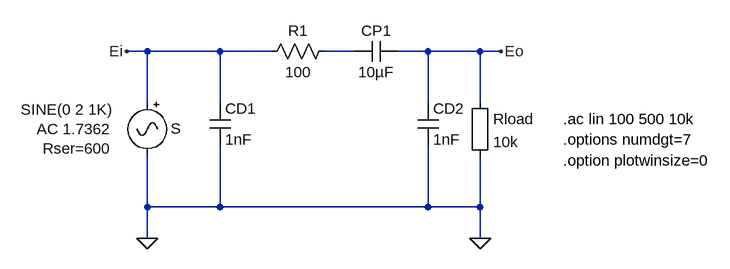
[diagram p0: schematic JT-11P-1HPC-Dhiru-Shorted-Via-Cap.asc]
JT-11P-1HPC-Dhiru-Shorted-Via-Cap.asc, the LTspice schematic file:
Version 4
SHEET 1 2372 788
WIRE 0 48 -32 48
WIRE 112 48 0 48
WIRE 192 48 112 48
WIRE 320 48 272 48
WIRE 432 48 384 48
WIRE 512 48 432 48
WIRE 544 48 512 48
WIRE 0 128 0 48
WIRE 112 128 112 48
WIRE 432 128 432 48
WIRE 512 128 512 48
WIRE 0 288 0 208
WIRE 112 288 112 192
WIRE 112 288 0 288
WIRE 432 288 432 192
WIRE 432 288 112 288
WIRE 512 288 512 208
WIRE 512 288 432 288
WIRE 0 336 0 288
WIRE 512 336 512 288
FLAG 512 336 0
FLAG 544 48 Eo
FLAG -32 48 Ei
FLAG 0 336 0
SYMBOL Misc\\signal 0 112 M0
WINDOW 0 -52 55 Left 2
WINDOW 3 53 26 Left 2
WINDOW 123 56 56 Left 2
WINDOW 39 55 86 Left 2
SYMATTR InstName S
SYMATTR Value SINE(0 2 1K)
SYMATTR Value2 AC 1.7362
SYMATTR SpiceLine Rser=600
SYMBOL Misc\\EuropeanResistor 496 112 R0
SYMATTR InstName Rload
SYMATTR Value 10k
SYMBOL cap 384 32 R90
WINDOW 0 0 32 VBottom 2
WINDOW 3 32 32 VTop 2
SYMATTR InstName CP1
SYMATTR Value 10µF
SYMBOL res 288 32 R90
WINDOW 0 0 56 VBottom 2
WINDOW 3 32 56 VTop 2
SYMATTR InstName R1
SYMATTR Value 100
SYMBOL cap 96 128 R0
SYMATTR InstName CD1
SYMATTR Value 1nF
SYMBOL cap 416 128 R0
SYMATTR InstName CD2
SYMATTR Value 1nF
TEXT 640 152 Left 2 !.ac lin 100 500 10k
TEXT 640 216 Left 2 !.option plotwinsize=0
TEXT 640 184 Left 2 !.options numdgt=7

The netlist it stands for:
* JT-11P-1HPC-Dhiru-Shorted-Via-Cap.asc
V§S Ei 0 SINE(0 2 1K) AC 1.7362 Rser=600
Rload Eo 0 10k
CP1 Eo N001 10µF
R1 N001 Ei 100
CD1 Ei 0 1nF
CD2 Eo 0 1nF
.ac lin 100 500 10k
.option plotwinsize=0
.options numdgt=7
.backanno
.end